# Altium schematic sheet Sensor.SchDoc
size A; SheetNumber: 3; SheetTotal: 5
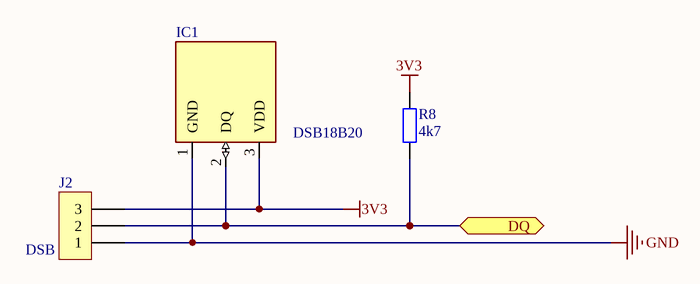
[diagram p0: Sensor.SchDoc]

## Parts
IC1  DSB18B20  [TO-92]
J2  DSB  [KF3-5.08]
R8  4k7  [RES-SMD-0805]

## Ports
DQ (bidir)

## Nets
3V3: IC1.3(VDD) J2.3 R8.2
GND: IC1.1(GND) J2.1
DQ: IC1.2(DQ) J2.2 R8.1 ; port DQ

## Library data of the parts
IC1 = DSB18B20: https://linhkien.cxt.vn/3083-ds18b20-temperature-sensors-55-to-125-c-to-92-3.html
J2 = KF3: Manufacturer: Würth Elektronik eiSos GmbH; partNo: 691103110003; ComponentLink1 Description: Manufacturer; ComponentLink2 Description: Datasheet; NoPins: 3; Created Date: 29 October 2013; ComponentLink1URL: http://www.we-online.com; ComponentLink2URL: http://katalog.we-online.de/em/datasheet/6911031100xx.pdf; Created by: Karrer Zheng
R8 = Resistor - SMD: Resistor SMD; Manufacturer: Generic Components; Class: Passive; Published: 08/06/2000; Publisher: Altium Hobart Technology Centre